# EAGLE design shinobi_BLE_connector (EAGLE 9.2.2)
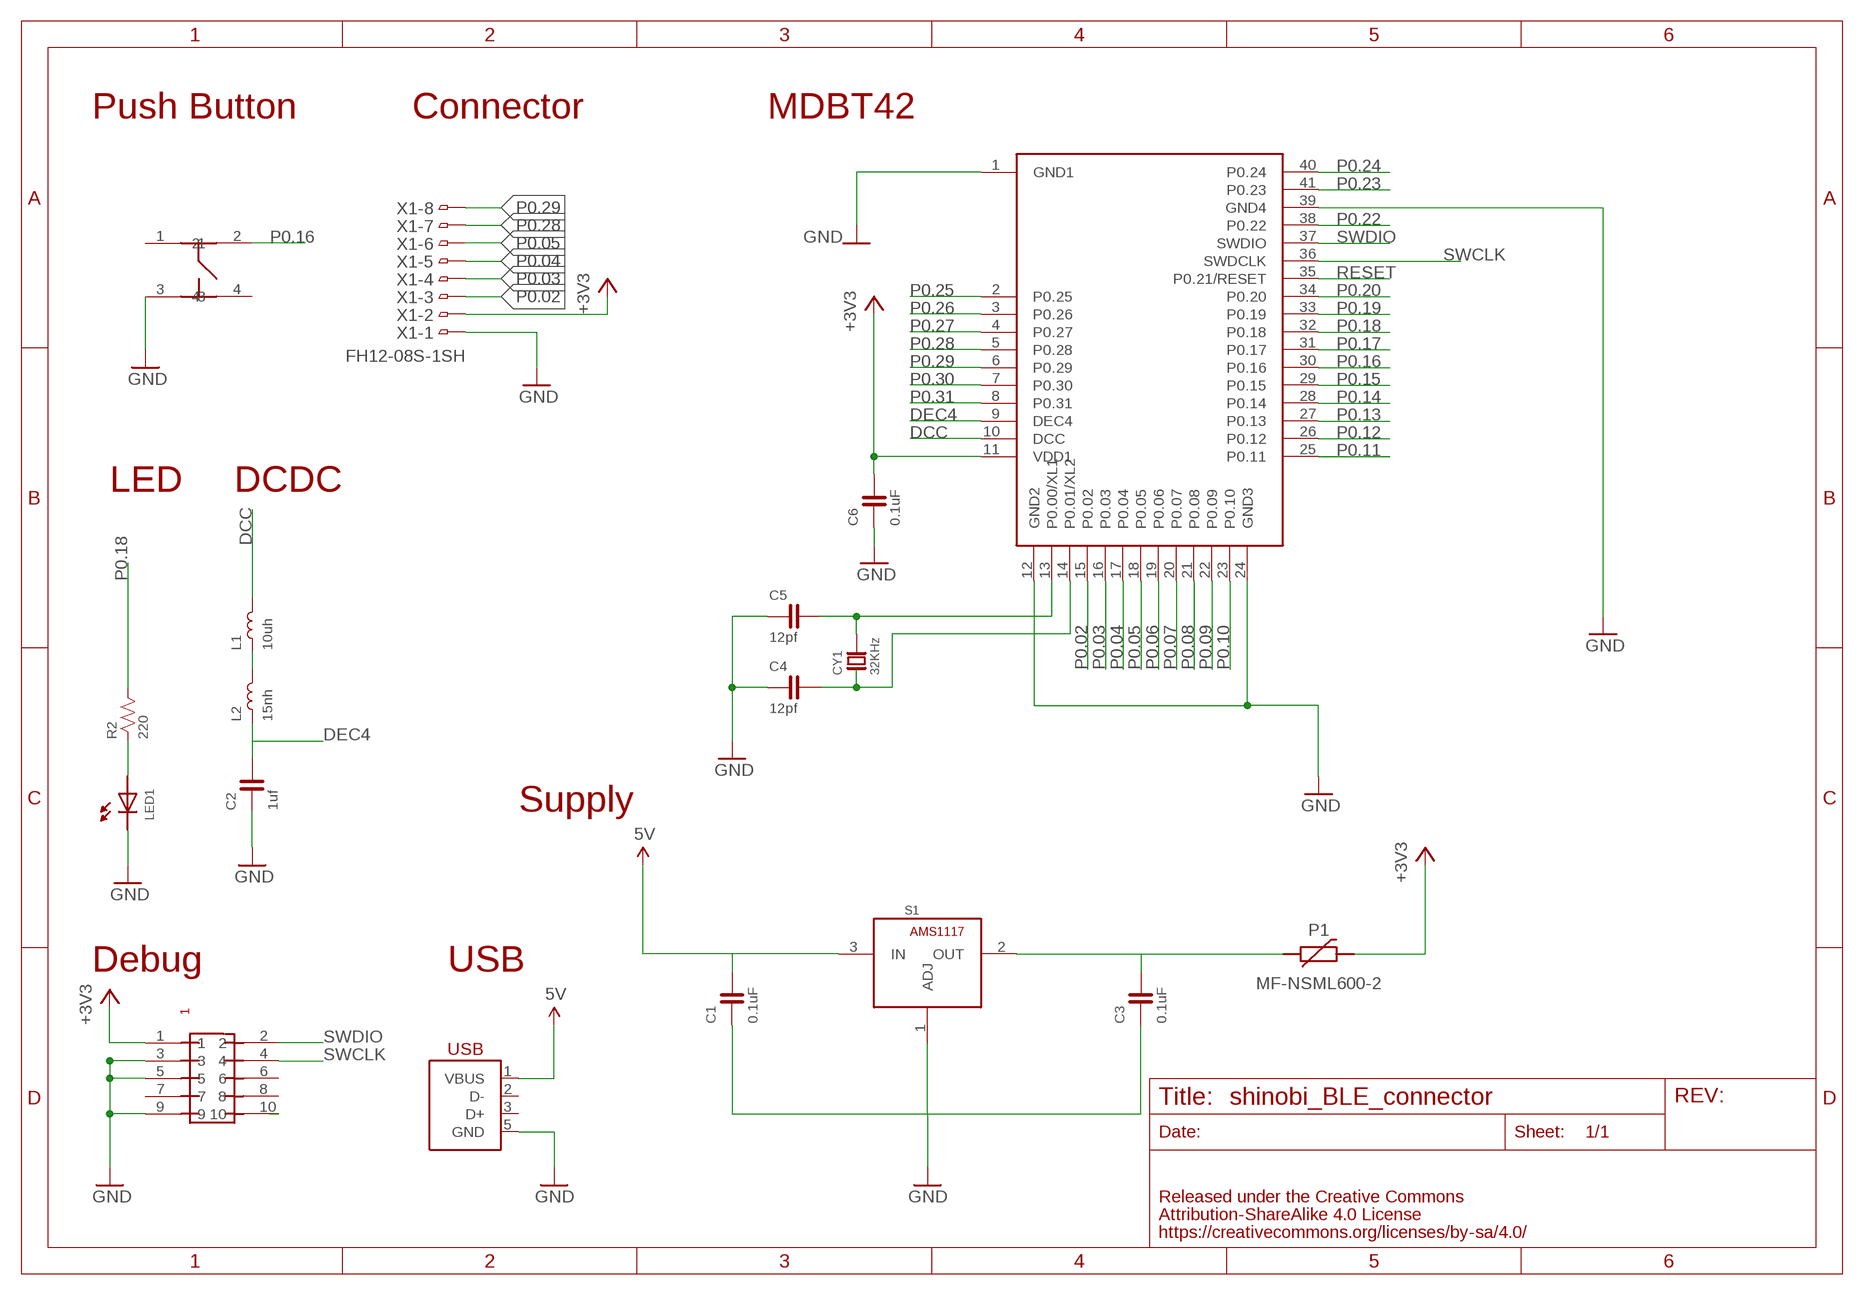
[diagram p0: schematic, sheet 1]

## Parts
C1  0.1uF  CAPACITOR-0603  [0603]
C2  1uf  CAPACITOR-0603  [0603]
C3  0.1uF  CAPACITOR-0603  [0603]
C4  12pf  CAPACITOR-0603  [0603]
C5  12pf  CAPACITOR-0603  [0603]
C6  0.1uF  CAPACITOR-0603  [0603]
CY1  32KHz  CRYSTAL-ABS07  [ABRACON-ABS07-32.768KHZ]
L1  10uh  INDUCTOR-0603  [0603]
L2  15nh  INDUCTOR-0603  [0603]
LED1  LED-0603  [0603]
P1  MF-NSML600-2  POLYSWITCH1206  [1206]
R2  220  RESISTOR-0603  [0603]
S1  AMS1117  [SOT-223-3]
U$2  RAYTAC-MDBT42  [RAYTAC-MDBT42]
U$4  PIN-HEADER-SMT(1.27MM)2X5  [PIN-HEADER-SMT(1.27MM)2X5]
U$5  SWICTH-4P(KMR2)  [SWITCH-4P(KMR2)]
USB1  USB-MICRO_B_SMT_HIROSE  [ZX62R-B-5P]
X1  FH12-08S-1SH  [FH12-08S-1SH]

## Nets
5V: C1.2 S1.3(IN) USB1.1(VBUS)
+3V3: C6.2 P1.P$2 U$2.11(VDD1) U$4.1 X1.2
DCC: L1.2 U$2.10(DCC)
DEC4: C2.2 L2.1 U$2.9(DEC4)
GND: C1.1 C2.1 C3.1 C4.1 C5.1 C6.1 LED1.CATHODE S1.1(ADJ) U$2.1(GND1) U$2.12(GND2) U$2.24(GND3) U$2.39(GND4) U$4.3 U$4.5 U$4.9 U$5.3 USB1.5(GND) X1.1
N$1: LED1.ANODE R2.1
N$2: L1.1 L2.2
N$5: C3.2 P1.P$1 S1.2(OUT)
N$7: C5.2 CY1.P$2 U$2.13(P0.00/XL1)
N$8: C4.2 CY1.P$1 U$2.14(P0.01/XL2)
P0.02: U$2.15(P0.02) X1.3
P0.03: U$2.16(P0.03) X1.4
P0.04: U$2.17(P0.04) X1.5
P0.05: U$2.18(P0.05) X1.6
P0.06: U$2.19(P0.06)
P0.07: U$2.20(P0.07)
P0.08: U$2.21(P0.08)
P0.09: U$2.22(P0.09)
P0.10: U$2.23(P0.10)
P0.11: U$2.25(P0.11)
P0.12: U$2.26(P0.12)
P0.13: U$2.27(P0.13)
P0.14: U$2.28(P0.14)
P0.15: U$2.29(P0.15)
P0.16: U$2.30(P0.16) U$5.2
P0.17: U$2.31(P0.17)
P0.18: R2.2 U$2.32(P0.18)
P0.19: U$2.33(P0.19)
P0.20: U$2.34(P0.20)
P0.22: U$2.38(P0.22)
P0.23: U$2.41(P0.23)
P0.24: U$2.40(P0.24)
P0.25: U$2.2(P0.25)
P0.26: U$2.3(P0.26)
P0.27: U$2.4(P0.27)
P0.28: U$2.5(P0.28) X1.7
P0.29: U$2.6(P0.29) X1.8
P0.30: U$2.7(P0.30)
P0.31: U$2.8(P0.31)
RESET: U$2.35(P0.21/RESET)
RESET1: U$4.10
SWCLK: U$2.36(SWDCLK) U$4.4
SWDIO: U$2.37(SWDIO) U$4.2
Unconnected: U$4.6 U$4.7 U$4.8 U$5.1 U$5.4 USB1.2(D-) USB1.3(D+)

## Notes on the sheet
- Push Button | Connector | MDBT42
- LED | DCDC
- Supply
- Debug | USB

## Library data of the parts
C1-C6 = FaBo-Capacitor:CAPACITOR: CAPACITOR
CY1 = FaBo-Crystal:CRYSTAL
L1 L2 = FaBo-Inductor:INDUCTOR: RESISTOR
LED1 = FaBo-LED:LED
P1 = FaBo-Supply:POLYSWITCH
R2 = FaBo-Resistors:RESISTOR: RESISTOR
S1 = FaBo-Supply:AMS1117
U$2 = FaBo-BT:RAYTAC-MDBT42
U$4 = gclue:PIN-HEADER-SMT(1.27MM)2X5: PIN-HEADER-SMT (1.27MM) 2x5
U$5 = gclue-test:SWICTH-4P(KMR2)
USB1 = FaBo-USB:USB
X1 = con-hirose:FH12-08S-1S: 1mm Pitch Connectors For FPC/FFC Source: Data sheet <http://www.hirose.co.jp/cataloge_hp/e58605370.pdf>; OC_FARNELL: unknown; OC_NEWARK: unknown

## Board
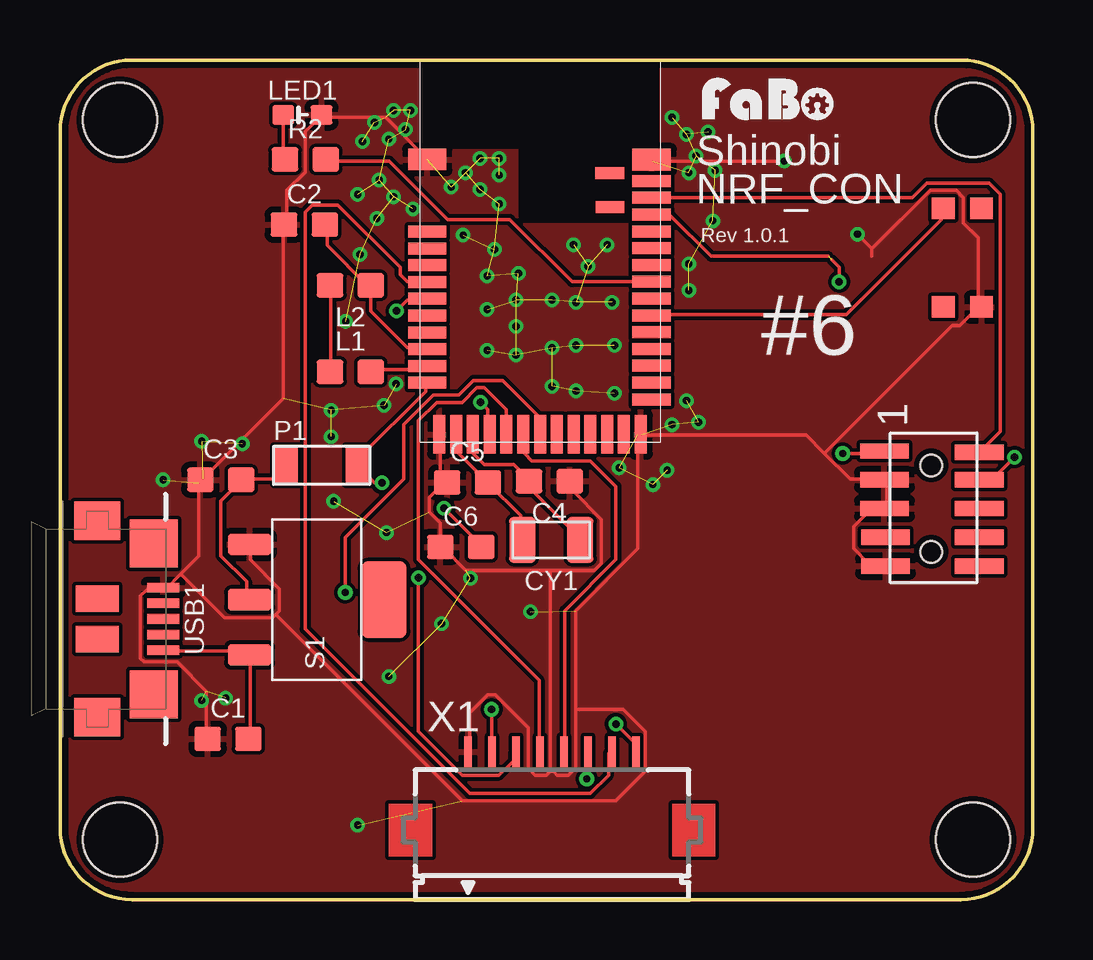
[diagram p1: board, top side]
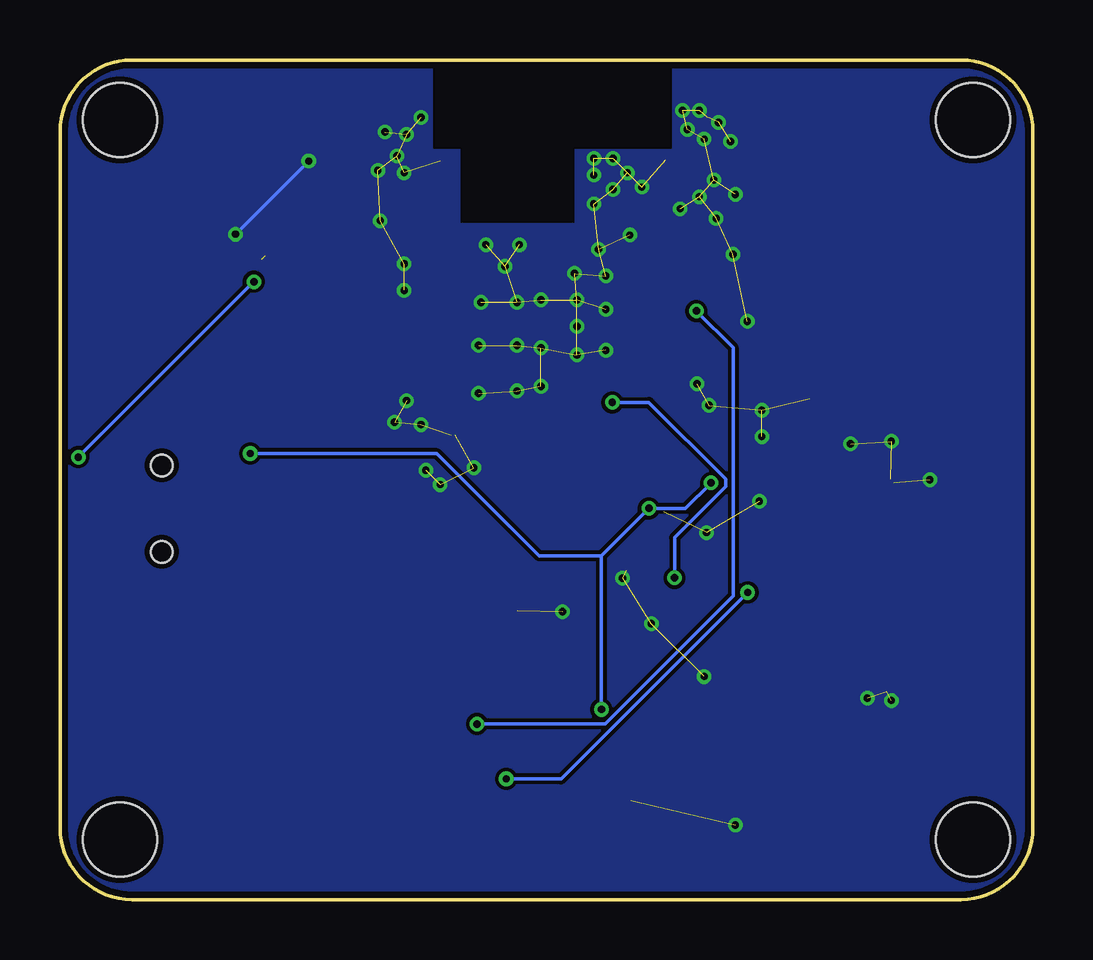
[diagram p2: board, bottom side, seen from below]

Size 40.54 x 35 mm. Coordinates in mm from the lower left corner, seen from the top.
Copper layers (1*16): Top 0.035mm / dielectric 1.5mm / Bottom 0.035mm
Design rules "SeeedStudio_2layer_DRU_no_angle_20140221": minimum track width 6mil, minimum drill 12mil, track to track 6mil, track to pad 6mil, pad to pad 6mil, via to via 6mil, smd to smd 0mil, copper to edge 10mil, drill to drill 10mil, minimum pad ring 10mil, minimum via ring 6mil, stop-mask expansion 2mil, vias tented up to drill 100mil, thermal gap 10mil

### Footprints (pad centres in the part's own frame; a part is rotated, then mirrored left to right if it is on the bottom)
0603 = smd 1.1 x 1: 1 -0.85,0; 2 0.85,0
ABRACON-ABS07-32.768KHZ = smd 1.1 x 1.9: P$1 -1.2,0; P$2 1.2,0
0603' = smd 0.9 x 0.8: ANODE -0.8,0; CATHODE 0.8,0
1206 = smd 1 x 1.6: P$1 -1.5,0; P$2 1.5,0
SOT-223-3 = smd 0.9 x 1.8: 1 -2.3,-2.8; 2 0,-2.8; 3 2.3,-2.8 | smd 3.2 x 1.9: 4 0,2.8
FABO-SHINOBI = hole 3.1: 2.5,32.5; 38.04,32.5; 38.04,2.5; 2.5,2.5
RAYTAC-MDBT42 = smd 1.6 x 0.9: 1 -4.7,3.8; 39 4.65,3.79 | smd 1.6 x 0.5: 2 -4.7,0.79; 3 -4.7,0.09; 4 -4.7,-0.61; 5 -4.7,-1.31; 6 -4.7,-2.01; 7 -4.7,-2.71; 8 -4.7,-3.41; 9 -4.7,-4.11; 10 -4.7,-4.81; 11 -4.7,-5.51; 25 4.65,-6.2; 26 4.65,-5.5; 27 4.65,-4.8; 28 4.65,-4.1; 29 4.65,-3.4; 30 4.65,-2.7; 31 4.65,-2; 32 4.65,-1.3; 33 4.65,-0.6; 34 4.65,0.1; 35 4.65,0.8; 36 4.65,1.5; 37 4.65,2.2; 38 4.65,2.9 | smd 0.5 x 1.6: 12 -4.2,-7.66; 13 -3.5,-7.66; 14 -2.8,-7.66; 15 -2.1,-7.66; 16 -1.4,-7.66; 17 -0.7,-7.66; 18 0,-7.66; 19 0.7,-7.66; 20 1.4,-7.66; 21 2.1,-7.66; 22 2.8,-7.66; 23 3.48,-7.66; 24 4.2,-7.66 | smd 1.2 x 0.5: 40 2.91,3.23; 41 2.92,1.81
PIN-HEADER-SMT(1.27MM)2X5 = smd 0.635 x 2.032: 1 -2.4,-1.95; 2 -2.35,2; 3 -1.2,-1.95; 4 -1.2,2; 5 0,-1.95; 6 0,2; 7 1.2,-1.9; 8 1.2,2; 9 2.4,-1.9; 10 2.4,2 | hole 0.9: 1.8,0; -1.8,0
SWITCH-4P(KMR2) = smd 0.9 x 0.95: 1 -1,0; 2 3.1,0; 3 -1,-1.6; 4 3.1,-1.6
ZX62R-B-5P = smd 0.4 x 1.35: 1 1.3,4.2; 2 0.65,4.2; 3 0,4.2; 4 -0.65,4.2; 5 -1.3,4.2 | smd 2 x 2: 6 3.15,3.8; 7 -3.15,3.8 | smd 1.6 x 1.9: 8 4.1,1.45; 11 -4.1,1.45 | smd 1.1 x 1.8: 9 0.85,1.45; 10 -0.85,1.45
FH12-08S-1SH = smd 0.3 x 1.3: 1 -3.5,3.25; 2 -2.5,3.25; 3 -1.5,3.25; 4 -0.5,3.25; 5 0.5,3.25; 6 1.5,3.25; 7 2.5,3.25; 8 3.5,3.25

### Placement (x,y rotation side)
C1  7,6.7 0 top
C2  10.18,28.14 0 top
C3  6.7,17.5 0 top
C4  20.39,17.44 180 top
C5  16.98,17.39 0 top
C6  16.7,14.7 0 top
CY1  20.47,14.99 180 top
L1  12.1,22 0 top
L2  12.1,25.6 180 top
LED1  [0603']  10.1,32.71 0 top
P1  10.9,18.1 0 top
R2  10.22,30.85 0 top
S1  10.7,12.5 270 top
U$1  [FABO-SHINOBI]  0,0 0 top
U$2  20,27.05 0 top
U$3  [LOGO_FABO_S]  29.55,32.35 0 top
U$4  36.3,16.3 270 top
U$5  36.8,25.71 90 top
USB1  0.1,11.7 270 top
X1  20.5,2.9 0 top

### Tracks (layer width: path | path; a pad name or v marks a point on that pad's centre or on a via)
5V
  Top 0.152: C1.2 7.92,6.71 7.92,10.06 S1.3 7.77,10.21 7.62,10.36 4.42,10.36 USB1.1
+3V3  (via drill 0.3)
  Top 0.152: v16,16.31 17.53,14.78 C6.2 | v13.41,17.37 13.11,17.37 12.5,17.98 P1.P$2 12.5,18.14 12.5,18.44 15.24,21.18 15.24,21.49 U$2.11 | v17.98,7.92 17.98,6.25 X1.2 | v32.61,18.59 34.29,18.59 U$4.1
  Bottom 0.152: v13.41,17.37 14.48,16.31 v16,16.31 17.98,14.33 | 17.98,14.33 v17.98,7.92 | v32.61,18.59 24.84,18.59 20.57,14.33 17.98,14.33
DCC
  Top 0.152: L1.2 12.95,22.1 15.24,22.1 U$2.10
DEC4
  Top 0.152: C2.2 11.12,28.04 11.12,27.28 12.8,25.6 L2.1 12.95,25.45 12.95,24.54 14.48,23.01 15.24,23.01 U$2.9
GND  (via drill 0.3)  (72 unrouted)
  Top 0.152: U$2.1 15.24,30.94 13.56,32.61 10.97,32.61 LED1.CATHODE 10.82,32.61 10.21,32 10.21,30.33 9.45,29.57 9.45,28.19 C2.1 9.3,28.04 9.3,20.88 5.94,17.53 C3.1 5.79,17.37 5.79,14.33 5.03,13.56 | C1.1 6.1,6.71 6.1,8.69 4.88,9.91 3.5,9.91 3.35,10.06 3.35,12.65 3.66,12.95 4.27,12.95 USB1.5 4.42,12.95 5.03,13.56 | 8.99,11.89 8.84,11.73 6.86,11.73 5.03,13.56 | 8.99,11.89 9.14,12.04 9.14,12.95 7.92,14.17 7.92,14.78 S1.1 | 20.42,13.72 16.92,13.72 16,14.63 C6.1 15.85,14.78 15.85,15.7 15.39,16.15 15.39,16.76 16,17.37 C5.1 16,17.53 15.85,17.68 15.85,19.36 U$2.12 | 20.42,13.72 22.25,13.72 22.55,14.02 22.55,15.85 21.34,17.07 21.34,17.37 C4.1 | 20.42,5.33 20.27,5.18 19.81,5.18 19.51,5.49 19.51,7.16 18.14,8.53 17.83,8.53 17.07,7.77 17.07,6.25 X1.1 | 20.42,13.72 20.42,5.33 | 31.85,18.59 32.92,17.53 34.29,17.53 U$4.3 34.44,17.37 34.44,16.31 U$4.5 34.29,16.15 33.68,16.15 33.07,15.54 33.07,14.63 33.68,14.02 34.29,14.02 U$4.9 | 31.85,18.59 31.09,19.36 24.23,19.36 U$2.24 24.08,19.36 24.08,14.63 21.49,12.04 21.49,7.92 | 33.83,27.13 36.27,29.57 37.34,29.57 37.64,29.26 37.64,28.19 38.25,27.58 38.25,24.84 U$5.3 38.25,24.69 37.49,23.93 37.19,23.93 31.85,18.59 | 33.83,26.82 33.83,27.13 | v30.18,30.79 24.69,30.79 U$2.39 | 33.83,27.13 v33.22,27.74 | 20.42,5.33 20.57,5.33 20.73,5.18 21.18,5.18 21.49,5.49 21.49,7.92 | 8.99,11.89 16.76,4.12 23.16,4.12 24.38,5.33 24.38,7.01 23.47,7.92 21.49,7.92
  Bottom 0.152: v33.22,27.74 v30.18,30.79
  other vias: 16.8,27.7 14.7,28.8 13.9,29.3 13.3,30 16.3,29.7 16.9,30.3 17.5,30.9 18.3,30.9 18.3,30.2 17.5,29.6 18.3,29 14.4,32.1 13.7,31.7 12.6,31.6 13.1,32.4 13.9,32.9 14.6,32.9 26.5,31 26.2,30.3 26.1,31.9 25.5,32.6 27,32 27.3,30.4 26.2,26.5 26.2,25.4 26.1,20.8 25.5,19.8 26.6,19.9 25.3,17.9 24.7,17.3 23.3,18 23.1,21.1 23.1,23.1 23,24.9 21.5,24.9 21.5,23.1 21.5,21.2 20.5,21.4 20.5,23 20.5,25 19.1,26.1 19,25 19,23.9 19,22.7 17.8,22.9 17.8,24.6 17.8,26 18.1,27.1 21.4,27.3 22.8,27.3 22,26.4 27.2,28.3 12.5,26.9 11.9,24.1 11.3,20.4 13.5,20.6 14,21.5 11.4,16.6 11.3,19.3 13.6,15.3 15.9,11.5 17.1,13.4 19.6,12 13.7,9.3 12.4,3.1 5.9,8.3 6.9,8.4 4.3,17.5 5.9,19.1 7.6,19 12.4,29.4 13.2,28.4
  pour Bottom: 0,0 0,35.56 40.64,35.56 40.64,0
  pour Top: 0,0 0,35.56 40.64,35.56 40.64,0
N$1
  Top 0.152: LED1.ANODE 9.3,32.61 9.3,30.94 R2.1
N$2
  Top 0.152: L1.1 11.28,22.1 11.28,25.45 L2.2
N$5
  Top 0.152: P1.P$1 9.3,17.98 8.84,17.53 7.62,17.53 C3.2 7.47,17.37 6.71,16.61 6.71,14.33 7.77,13.26 7.77,12.65 S1.2
N$7
  Top 0.152: U$2.13 16.61,19.36 16.61,18.59 17.68,17.53 C5.2 17.83,17.37 19.2,16 19.2,15.09 CY1.P$2
N$8
  Top 0.152: CY1.P$1 21.64,15.09 19.66,17.07 19.66,17.37 C4.2 19.51,17.53 18.9,18.14 17.68,18.14 17.22,18.59 17.22,19.36 U$2.14
P0.02  (via drill 0.3)
  Top 0.152: v14.94,13.41 14.94,7.01 16.76,5.18 18.29,5.18 18.9,5.79 18.9,6.1 X1.3 | v17.53,20.73 17.83,20.42 17.83,19.51 U$2.15
  Bottom 0.152: v14.94,13.41 14.94,15.09 12.8,17.22 12.8,17.53 16,20.73 v17.53,20.73
P0.03
  Top 0.152: X1.4 19.96,6.25 19.96,9.14 14.94,14.17 14.94,19.96 15.7,20.73 16.76,20.73 17.37,21.34 17.68,21.34 18.59,20.42 18.59,19.51 U$2.16
P0.04
  Top 0.152: X1.5 21.03,6.25 21.03,12.04 23.16,14.17 23.16,17.22 22.1,18.29 19.66,18.29 19.36,18.59 19.36,19.36 U$2.17
P0.05  (via drill 0.3)
  Top 0.152: v21.95,5.03 21.95,6.1 X1.6 | v11.89,12.8 11.89,15.09 14.33,17.53 14.33,19.81 15.54,21.03 16.61,21.03 17.22,21.64 18.44,21.64 19.96,20.12 19.96,19.51 U$2.18
  Bottom 0.152: v21.95,5.03 19.66,5.03 v11.89,12.8
P0.16
  Top 0.152: U$5.2 36.73,28.8 36.73,28.35 32.77,24.38 24.69,24.38 U$2.30
P0.18
  Top 0.152: R2.2 11.12,30.79 13.72,30.79 16.15,28.35 18.75,28.35 21.34,25.76 24.54,25.76 U$2.32
P0.28
  Top 0.152: X1.7 22.86,6.1 22.86,5.18 22.1,4.42 17.07,4.42 10.21,11.28 10.21,28.65 10.52,28.96 11.58,28.96 14.17,26.36 14.17,26.06 14.48,25.76 15.24,25.76 U$2.5
P0.29  (via drill 0.3)
  Top 0.152: v23.16,7.32 23.93,6.55 23.93,6.25 X1.8 | v14.02,24.54 14.48,24.99 15.24,24.99 U$2.6
  Bottom 0.152: v23.16,7.32 17.83,7.32 12.5,12.65 12.5,23.01 v14.02,24.54
SWCLK  (via drill 0.3)  (1 unrouted)
  Top 0.152: 32,26.82 27.13,26.82 25.45,28.5 24.69,28.5 U$2.36 | v39.78,18.44 38.86,17.53 38.41,17.53 U$4.4 | v32.46,25.76 32.46,26.36 32.16,26.67
  Bottom 0.152: v32.46,25.76 v39.78,18.44
SWDIO
  Top 0.152: U$2.37 24.69,29.26 35.51,29.26 36.12,29.87 38.71,29.87 39.17,29.41 39.17,19.51 38.41,18.75 U$4.2

### Text on the board
tPlace: Shinobi | NRF_CON | Rev 1.0.1 | #6